# Altium schematic sheet pay.SchDoc: Payload
size A4; DocumentNumber: 7; SheetNumber: 7; SheetTotal: 8
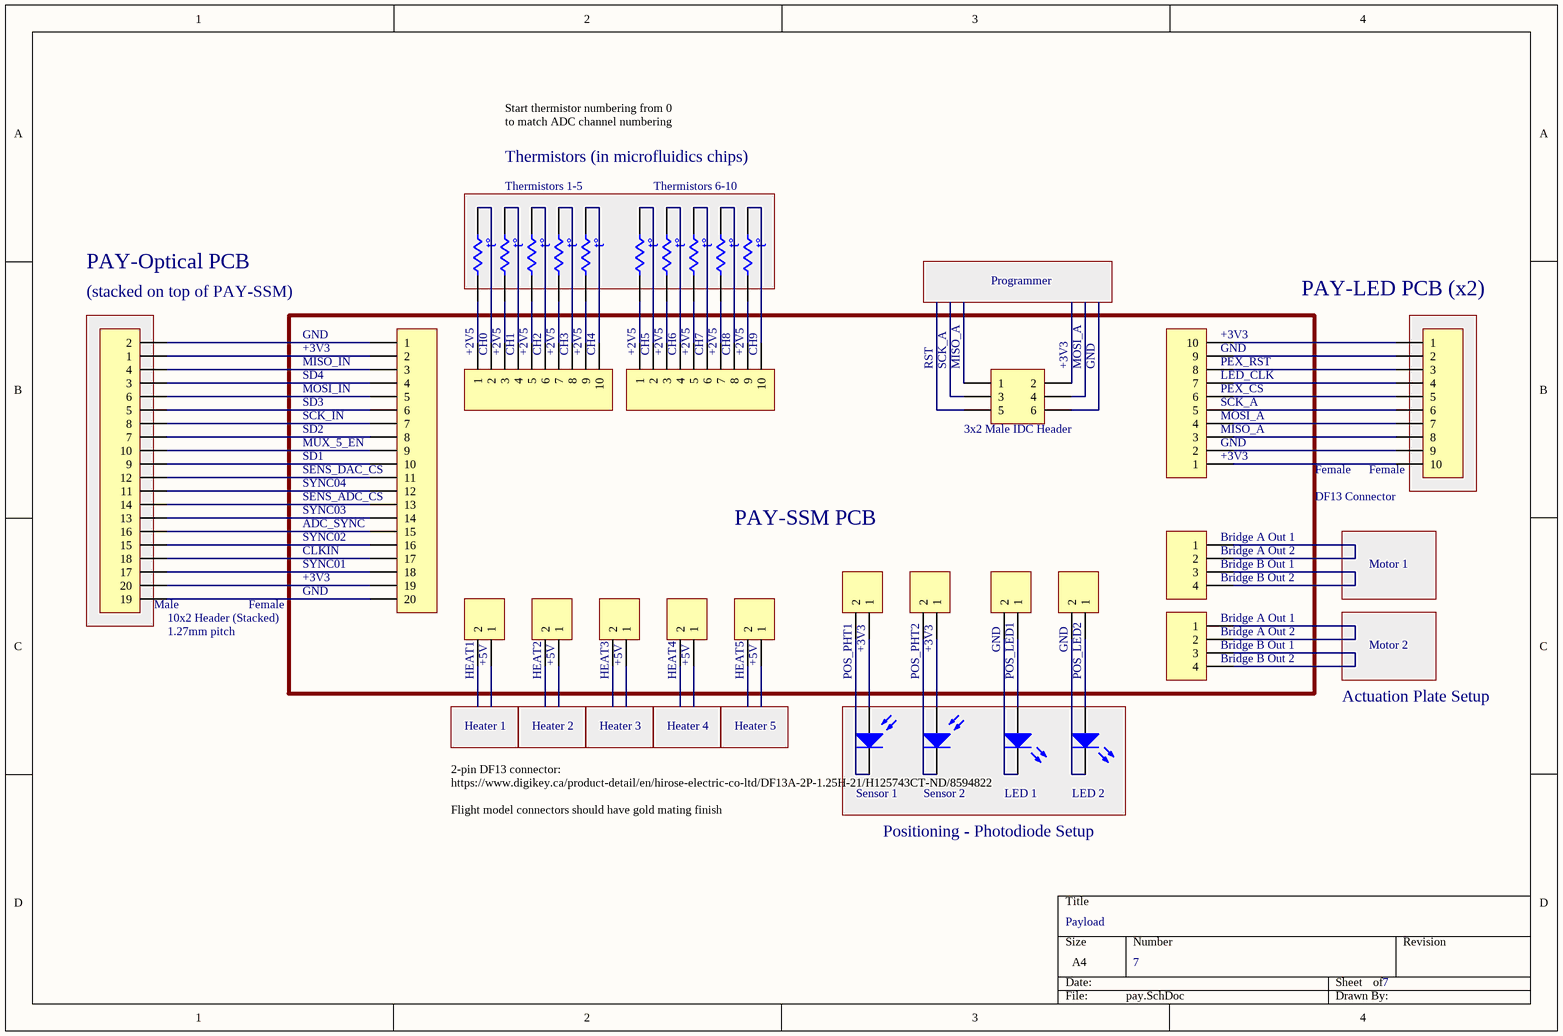
[diagram p0: pay.SchDoc]

## Parts
(Parts that share a designator on the sheet are numbered #1, #2 ... from top to bottom, then left to right.)
D?#1  Photo Sen  [PIN2]  (value not drawn)
D?#2  Photo Sen  [PIN2]  (value not drawn)
D?#3  LED0  [LED-0]  (value not drawn)
D?#4  LED0  [LED-0]  (value not drawn)
P?#1  Header 20  [HDR1X20]  (value not drawn)
P?#2  Header 20  [HDR1X20]  (value not drawn)
P?#3  Header 10  [HDR1X10]  (value not drawn)
P?#4  Header 10  [HDR1X10]  (value not drawn)
P?#5  Header 10  [HDR1X10]  (value not drawn)
P?#6  Header 3X2  [HDR2X3]  (value not drawn)
P?#7  Header 10  [HDR1X10]  (value not drawn)
P?#8  Header 4  [HDR1X4]  (value not drawn)
P?#9  Header 2  [HDR1X2]  (value not drawn)
P?#10  Header 2  [HDR1X2]  (value not drawn)
P?#11  Header 2  [HDR1X2]  (value not drawn)
P?#12  Header 2  [HDR1X2]  (value not drawn)
P?#13  Header 4  [HDR1X4]  (value not drawn)
P?#14  Header 2  [HDR1X2]  (value not drawn)
P?#15  Header 2  [HDR1X2]  (value not drawn)
P?#16  Header 2  [HDR1X2]  (value not drawn)
P?#17  Header 2  [HDR1X2]  (value not drawn)
P?#18  Header 2  [HDR1X2]  (value not drawn)
RT?#1  Res Thermal  [6-0805_N]  (value not drawn)
RT?#2  Res Thermal  [6-0805_N]  (value not drawn)
RT?#3  Res Thermal  [6-0805_N]  (value not drawn)
RT?#4  Res Thermal  [6-0805_N]  (value not drawn)
RT?#5  Res Thermal  [6-0805_N]  (value not drawn)
RT?#6  Res Thermal  [6-0805_N]  (value not drawn)
RT?#7  Res Thermal  [6-0805_N]  (value not drawn)
RT?#8  Res Thermal  [6-0805_N]  (value not drawn)
RT?#9  Res Thermal  [6-0805_N]  (value not drawn)
RT?#10  Res Thermal  [6-0805_N]  (value not drawn)

## Blocks framed on the sheet
(stacked on top of PAY-SSM): P?#1

## Nets
NetD?#1_1: D?#1.1(A) P?#9.1
NetD?#1_2: D?#1.2(K) P?#9.2
NetD?#2_1: D?#2.1(A) P?#10.1
NetD?#2_2: D?#2.2(K) P?#10.2
NetD?#3_1: D?#3.1(A) P?#11.1
NetD?#3_2: D?#3.2(K) P?#11.2
NetD?#4_1: D?#4.1(A) P?#12.1
NetD?#4_2: D?#4.2(K) P?#12.2
NetP?#1_1: P?#1.1(2) P?#2.1
NetP?#1_2: P?#1.2(1) P?#2.2
NetP?#1_3: P?#1.3(4) P?#2.3
NetP?#1_4: P?#1.4(3) P?#2.4
NetP?#1_5: P?#1.5(6) P?#2.5
NetP?#1_6: P?#1.6(5) P?#2.6
NetP?#1_7: P?#1.7(8) P?#2.7
NetP?#1_8: P?#1.8(7) P?#2.8
NetP?#1_9: P?#1.9(10) P?#2.9
NetP?#1_10: P?#1.10(9) P?#2.10
NetP?#1_11: P?#1.11(12) P?#2.11
NetP?#1_12: P?#1.12(11) P?#2.12
NetP?#1_13: P?#1.13(14) P?#2.13
NetP?#1_14: P?#1.14(13) P?#2.14
NetP?#1_15: P?#1.15(16) P?#2.15
NetP?#1_16: P?#1.16(15) P?#2.16
NetP?#1_17: P?#1.17(18) P?#2.17
NetP?#1_18: P?#1.18(17) P?#2.18
NetP?#1_19: P?#1.19(20) P?#2.19
NetP?#1_20: P?#1.20(19) P?#2.20
NetP?#3_1: P?#3.1 P?#7.10
NetP?#3_2: P?#3.2 P?#7.9
NetP?#3_3: P?#3.3 P?#7.8
NetP?#3_4: P?#3.4 P?#7.7
NetP?#3_5: P?#3.5 P?#7.6
NetP?#3_6: P?#3.6 P?#7.5
NetP?#3_7: P?#3.7 P?#7.4
NetP?#3_8: P?#3.8 P?#7.3
NetP?#3_9: P?#3.9 P?#7.2
NetP?#3_10: P?#3.10 P?#7.1
NetP?#4_1: P?#4.1 RT?#1.2
NetP?#4_2: P?#4.2 RT?#1.1
NetP?#4_3: P?#4.3 RT?#2.2
NetP?#4_4: P?#4.4 RT?#2.1
NetP?#4_5: P?#4.5 RT?#3.2
NetP?#4_6: P?#4.6 RT?#3.1
NetP?#4_7: P?#4.7 RT?#4.2
NetP?#4_8: P?#4.8 RT?#4.1
NetP?#4_9: P?#4.9 RT?#5.2
NetP?#4_10: P?#4.10 RT?#5.1
NetP?#5_1: P?#5.1 RT?#6.2
NetP?#5_2: P?#5.2 RT?#6.1
NetP?#5_3: P?#5.3 RT?#7.2
NetP?#5_4: P?#5.4 RT?#7.1
NetP?#5_5: P?#5.5 RT?#8.2
NetP?#5_6: P?#5.6 RT?#8.1
NetP?#5_7: P?#5.7 RT?#9.2
NetP?#5_8: P?#5.8 RT?#9.1
NetP?#5_9: P?#5.9 RT?#10.2
NetP?#5_10: P?#5.10 RT?#10.1
NetP?#8_1: P?#8.1 P?#8.2
NetP?#8_3: P?#8.3 P?#8.4
NetP?#13_1: P?#13.1 P?#13.2
NetP?#13_3: P?#13.3 P?#13.4

Not connected (* = marked no-connect by the designer): P?#6 1 2 3 4 5 6; P?#14 1 2; P?#15 1 2; P?#16 1 2; P?#17 1 2; P?#18 1 2

## Notes on the sheet
- Thermistors (in microfluidics chips)
- Start thermistor numbering from 0 to match ADC channel numbering
- (near RT?#2) Thermistors 1-5
- (near RT?#7) Thermistors 6-10
- PAY-Optical PCB
- Programmer
- (near P?#3) PAY-LED PCB (x2)
- +3V3
- GND
- (near P?#2) MISO_IN
- SD4
- (near P?#4) +2V5
- (near P?#4) CH0
- (near P?#4) CH1
- (near P?#4) CH2
- (near P?#4) CH3
- (near P?#4) CH4
- (near P?#5) +2V5
- (near P?#5) CH5
- (near P?#5) CH6
- (near P?#5) CH7
- (near P?#5) CH8
- (near P?#5) CH9
- RST
- (near P?#6) SCK_A
- (near P?#6) MISO_A
- (near P?#6) +3V3
- (near P?#6) MOSI_A
- (near P?#6) GND
- (near P?#7) +3V3
- (near P?#7) GND
- (near P?#7) PEX_RST
- (near P?#7) LED_CLK
- (near P?#2) MOSI_IN
- SD3
- SCK_IN
- SD2
- (near P?#2) MUX_5_EN
- (near P?#6) 3x2 Male IDC Header
- (near P?#7) PEX_CS
- (near P?#7) SCK_A
- (near P?#7) MOSI_A
- (near P?#7) MISO_A
- SD1
- SYNC04
- (near P?#2) SENS_DAC_CS
- (near P?#2) SENS_ADC_CS
- SYNC03
- (near P?#3) DF13 Connector
- Female
- (near P?#3) Female
- (near P?#2) ADC_SYNC
- SYNC02
- CLKIN
- SYNC01
- PAY-SSM PCB
- (near P?#8) Bridge A Out 1
- (near P?#8) Bridge A Out 2
- (near P?#8) Bridge B Out 1
- (near P?#8) Bridge B Out 2
- Motor 1
- (near P?#1) Male
- (near P?#1) 10x2 Header (Stacked)
- (near P?#1) 1.27mm pitch
- (near P?#9) +3V3
- (near P?#10) +3V3
- (near P?#11) GND
- (near P?#12) GND
- (near P?#13) Bridge A Out 1
- (near P?#13) Bridge A Out 2
- (near P?#13) Bridge B Out 1
- Motor 2
- (near P?#14) HEAT1
- (near P?#14) +5V
- (near P?#15) HEAT2
- (near P?#15) +5V
- (near P?#16) HEAT3
- (near P?#16) +5V
- (near P?#17) HEAT4
- (near P?#17) +5V
- (near P?#18) HEAT5
- (near P?#18) +5V
- (near P?#9) POS_PHT1
- (near P?#10) POS_PHT2
- (near P?#11) POS_LED1
- (near P?#12) POS_LED2
- (near P?#13) Bridge B Out 2
- Actuation Plate Setup
- Heater 1
- Heater 2
- Heater 3
- Heater 4
- Heater 5
- 2-pin DF13 connector:
  https://www.digikey.ca/product-detail/en/hirose-electric-co-ltd/DF13A-2P-1.25H-21/H125743CT-ND/8594822
  Flight model connectors should have gold mating finish
- (near D?#1) Sensor 1
- Positioning - Photodiode Setup
- (near D?#2) Sensor 2
- (near D?#3) LED 1
- (near D?#4) LED 2
- (in symbol Res Thermal) t°

## Library data of the parts
D?#1 D?#2 = Photo Sen: Photosensitive Diode; Published: 24-Mar-1999; LatestRevisionDate: 17-Jul-2002; LatestRevisionNote: Re-released for DXP Platform.; PackageReference: PIN2; Publisher: Altium Limited
D?#3 D?#4 = LED0: Typical INFRARED GaAs LED; Published: 8-Jun-2000; LatestRevisionDate: 08-Jul-2005; LatestRevisionNote: Mech Layer 1 removed.; PackageReference: LED-0; Publisher: Altium Limited; PackageDescription: LED; 2 Leads
P?#1 P?#2 = Header 20: Header, 20-Pin; LatestRevisionDate: 17-Jul-2002; LatestRevisionNote: Re-released for DXP Platform.; Publisher: Altium Limited
P?#3-P?#5 P?#7 = Header 10: Header, 10-Pin; LatestRevisionDate: 17-Jul-2002; LatestRevisionNote: Re-released for DXP Platform.; Publisher: Altium Limited
P?#6 = Header 3X2: Header, 3-Pin, Dual row; LatestRevisionDate: 17-Jul-2002; LatestRevisionNote: Re-released for DXP Platform.; Publisher: Altium Limited
P?#8 P?#13 = Header 4: Header, 4-Pin; LatestRevisionDate: 17-Jul-2002; LatestRevisionNote: Re-released for DXP Platform.; Publisher: Altium Limited
P?#9-P?#12 P?#14-P?#18 = Header 2: Header, 2-Pin; LatestRevisionDate: 17-Jul-2002; LatestRevisionNote: Re-released for DXP Platform.; Publisher: Altium Limited
RT?#1-RT?#10 = Res Thermal: Thermistor; Published: 24-Mar-1999; LatestRevisionDate: 29-May-2009; LatestRevisionNote: IPC-7351 Footprint Added.; PackageVersion: Mar-2003; PackageReference: 6-0805; Publisher: Altium Limited; PackageDescription: Chip Resistor 0805 Case Size; Code_IPC: RESC2012